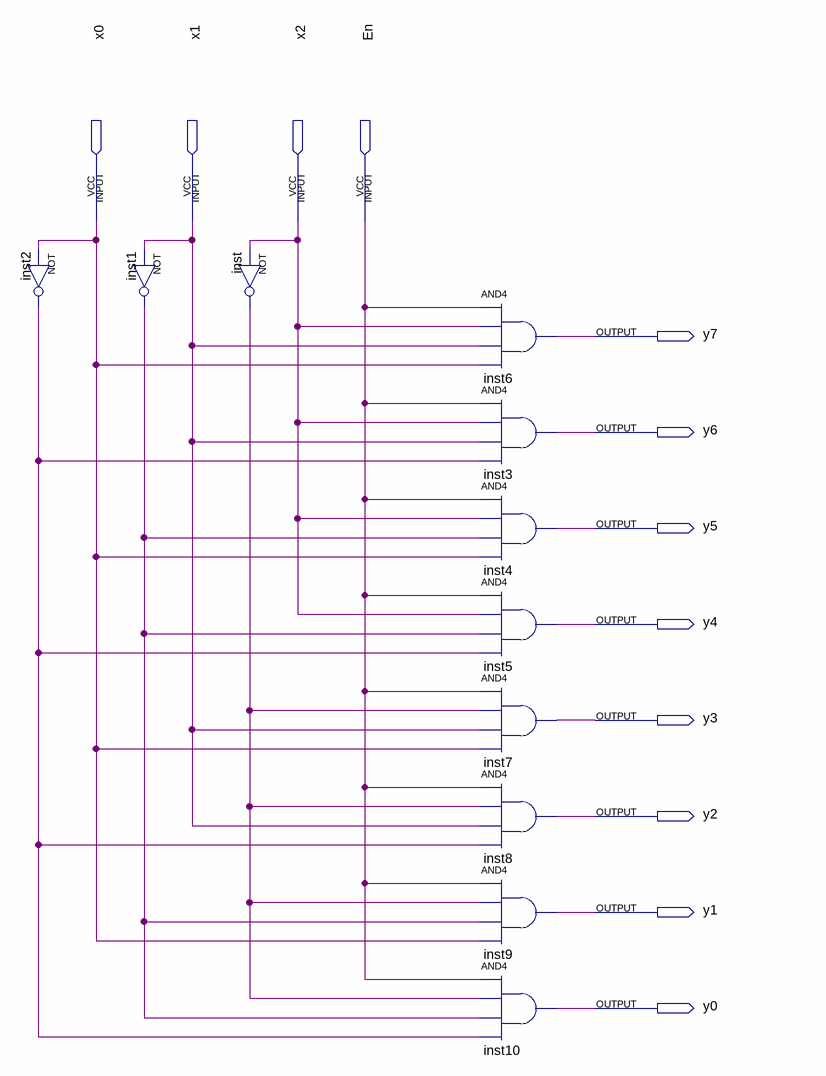
[diagram p0: schematic sheet]
// Quartus schematic Problema3.bdf as structural Verilog: 11 symbols, 12 pins
module Problema3 (
  input  x0,
  input  x1,
  input  x2,
  input  En,
  output y7,
  output y6,
  output y5,
  output y4,
  output y3,
  output y2,
  output y1,
  output y0
);

  wire inst1_out, inst2_out, inst_out;

  not inst2 (inst2_out, x0);
  not inst1 (inst1_out, x1);
  not inst (inst_out, x2);
  and inst6 (y7, En, x2, x1, x0);
  and inst3 (y6, En, x2, x1, inst2_out);
  and inst4 (y5, En, x2, inst1_out, x0);
  and inst5 (y4, En, x2, inst1_out, inst2_out);
  and inst7 (y3, En, inst_out, x1, x0);
  and inst8 (y2, En, inst_out, x1, inst2_out);
  and inst9 (y1, En, inst_out, inst1_out, x0);
  and inst10 (y0, En, inst_out, inst1_out, inst2_out);
endmodule
